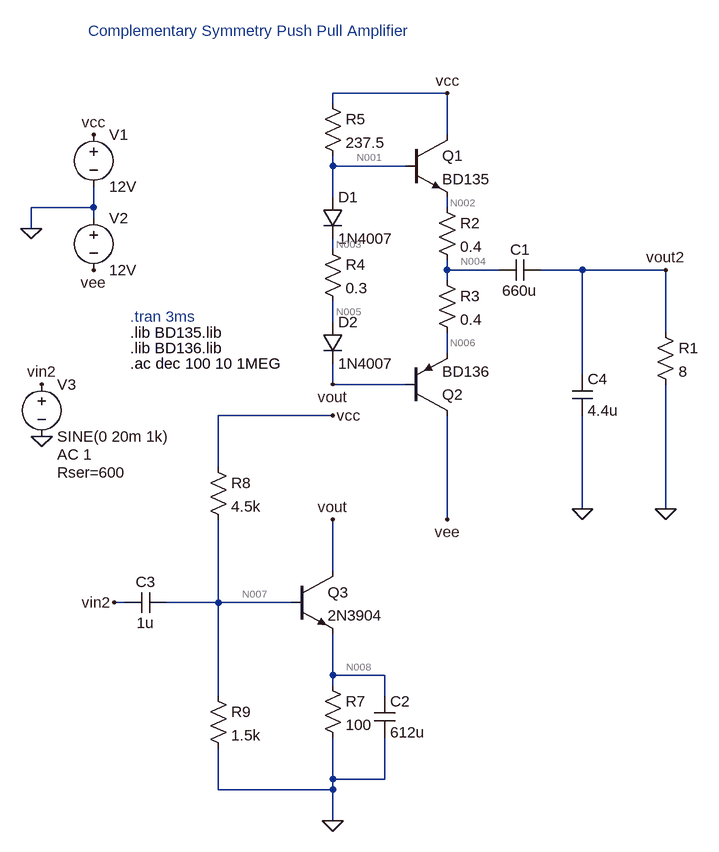
[diagram p0: schematic push_pull_AB.asc]
push_pull_AB.asc, the LTspice schematic file:
Version 4.1
SHEET 1 1272 1044
WIRE 880 -128 704 -128
WIRE 704 -112 704 -128
WIRE 880 -64 880 -128
WIRE 704 -16 704 -32
WIRE 816 -16 704 -16
WIRE 704 32 704 -16
WIRE 336 48 336 16
WIRE 336 48 240 48
WIRE 880 48 880 32
WIRE 336 64 336 48
WIRE 240 80 240 48
WIRE 704 112 704 96
WIRE 880 144 880 128
WIRE 960 144 880 144
WIRE 1088 144 1024 144
WIRE 1216 144 1088 144
WIRE 880 160 880 144
WIRE 704 224 704 192
WIRE 1216 240 1216 144
WIRE 880 272 880 240
WIRE 1088 304 1088 144
WIRE 704 320 704 288
WIRE 816 320 704 320
WIRE 704 368 528 368
WIRE 528 448 528 368
WIRE 1088 512 1088 368
WIRE 1216 512 1216 320
WIRE 880 528 880 368
WIRE 704 608 704 528
WIRE 384 656 368 656
WIRE 528 656 528 528
WIRE 528 656 448 656
WIRE 640 656 528 656
WIRE 704 768 704 704
WIRE 784 768 704 768
WIRE 704 784 704 768
WIRE 528 800 528 656
WIRE 784 800 784 768
WIRE 704 928 704 864
WIRE 784 928 784 864
WIRE 784 928 704 928
WIRE 528 944 528 880
WIRE 704 944 704 928
WIRE 704 944 528 944
WIRE 704 992 704 944
FLAG 336 -64 vcc
FLAG 240 80 0
FLAG 1216 512 0
FLAG 880 -128 vcc
FLAG 1216 144 vout2
FLAG 704 992 0
FLAG 256 320 vin2
FLAG 368 656 vin2
FLAG 704 368 vcc
FLAG 256 400 0
FLAG 704 320 vout
FLAG 704 528 vout
FLAG 1088 512 0
FLAG 336 144 vee
FLAG 880 528 vee
SYMBOL voltage 336 -80 R0
WINDOW 123 0 0 Left 0
WINDOW 39 0 0 Left 0
SYMATTR InstName V1
SYMATTR Value 12V
SYMBOL npn 816 -64 R0
SYMATTR InstName Q1
SYMATTR Value BD135
SYMBOL pnp 816 368 M180
SYMATTR InstName Q2
SYMATTR Value BD136
SYMBOL res 1200 224 R0
SYMATTR InstName R1
SYMATTR Value 8
SYMBOL res 864 32 R0
SYMATTR InstName R2
SYMATTR Value 0.4
SYMBOL res 864 144 R0
SYMATTR InstName R3
SYMATTR Value 0.4
SYMBOL res 688 96 R0
SYMATTR InstName R4
SYMATTR Value 0.3
SYMBOL diode 688 32 R0
SYMATTR InstName D1
SYMATTR Value 1N4007
SYMBOL diode 688 224 R0
SYMATTR InstName D2
SYMATTR Value 1N4007
SYMBOL res 688 -128 R0
SYMATTR InstName R5
SYMATTR Value 237.5
SYMBOL npn 640 608 R0
SYMATTR InstName Q3
SYMATTR Value 2N3904
SYMBOL res 688 768 R0
SYMATTR InstName R7
SYMATTR Value 100
SYMBOL res 512 432 R0
SYMATTR InstName R8
SYMATTR Value 4.5k
SYMBOL res 512 784 R0
SYMATTR InstName R9
SYMATTR Value 1.5k
SYMBOL cap 768 800 R0
SYMATTR InstName C2
SYMATTR Value 612u
SYMBOL cap 384 640 M90
WINDOW 0 0 32 VBottom 2
WINDOW 3 32 32 VTop 2
SYMATTR InstName C3
SYMATTR Value 1u
SYMBOL voltage 256 304 R0
WINDOW 123 24 124 Left 2
WINDOW 39 24 152 Left 2
SYMATTR Value2 AC 1
SYMATTR SpiceLine Rser=600
SYMATTR InstName V3
SYMATTR Value SINE(0 20m 1k)
SYMBOL cap 1072 304 R0
SYMATTR InstName C4
SYMATTR Value 4.4u
SYMBOL voltage 336 48 R0
WINDOW 123 0 0 Left 0
WINDOW 39 0 0 Left 0
SYMATTR InstName V2
SYMATTR Value 12V
SYMBOL cap 1024 128 R90
WINDOW 0 0 32 VBottom 2
WINDOW 3 32 32 VTop 2
SYMATTR InstName C1
SYMATTR Value 660u
TEXT 392 240 Left 2 !.lib BD135.lib
TEXT 392 264 Left 2 !.lib BD136.lib
TEXT 392 216 Left 2 ;.tran 3ms
TEXT 392 288 Left 2 !.ac dec 100 10 1MEG
TEXT 328 -224 Left 2 ;Complementary Symmetry Push Pull Amplifier

The netlist it stands for:
* push_pull_AB.asc
V1 vcc 0 12V
Q1 vcc N001 N002 0 BD135
Q2 vee vout N006 0 BD136
R1 vout2 0 8
R2 N002 N004 0.4
R3 N004 N006 0.4
R4 N003 N005 0.3
D1 N001 N003 1N4007
D2 N005 vout 1N4007
R5 vcc N001 237.5
Q3 vout N007 N008 0 2N3904
R7 N008 0 100
R8 vcc N007 4.5k
R9 N007 0 1.5k
C2 N008 0 612u
C3 vin2 N007 1u
V3 vin2 0 SINE(0 20m 1k) AC 1 Rser=600
C4 vout2 0 4.4u
V2 0 vee 12V
C1 vout2 N004 660u
.model D D
.lib standard.dio
.model NPN NPN
.model PNP PNP
.lib standard.bjt
.lib BD135.lib
.lib BD136.lib
* .tran 3ms
.ac dec 100 10 1MEG
* Complementary Symmetry Push Pull Amplifier
.backanno
.end

* Results of the author's LTspice run, read from the files saved beside the schematic
* Operating Point, zero values left out:
*   V(n001) = 6.844 V
*   V(vee) = -12 V
*   V(vout) = 5.438 V
*   V(n005) = 6.138 V
*   V(n008) = 2.177 V
*   V(vcc) = 12 V
*   V(n002) = 6.162 V
*   V(n006) = 6.153 V
*   V(n004) = 6.158 V
*   V(n003) = 6.145 V
*   V(n007) = 2.916 V
*   I(V1) = -35.4 mA
*   Ic(Q2) = -11.69 mA
*   Ib(Q2) = -62.91 µA
*   Ie(Q2) = 11.75 mA
*   I(R2) = 11.75 mA
*   I(R3) = 11.75 mA
*   I(R8) = 2.019 mA
*   I(R9) = 1.944 mA
*   I(D1) = 21.64 mA
*   Ic(Q3) = 21.7 mA
*   Ib(Q3) = 74.29 µA
*   Ie(Q3) = -21.77 mA
*   I(V2) = -11.69 mA
*   Ic(Q1) = 11.68 mA
*   Ib(Q1) = 72.35 µA
*   Ie(Q1) = -11.75 mA
*   I(R4) = 21.64 mA
*   I(R5) = 21.71 mA
*   I(R7) = 21.77 mA
*   I(D2) = 21.64 mA
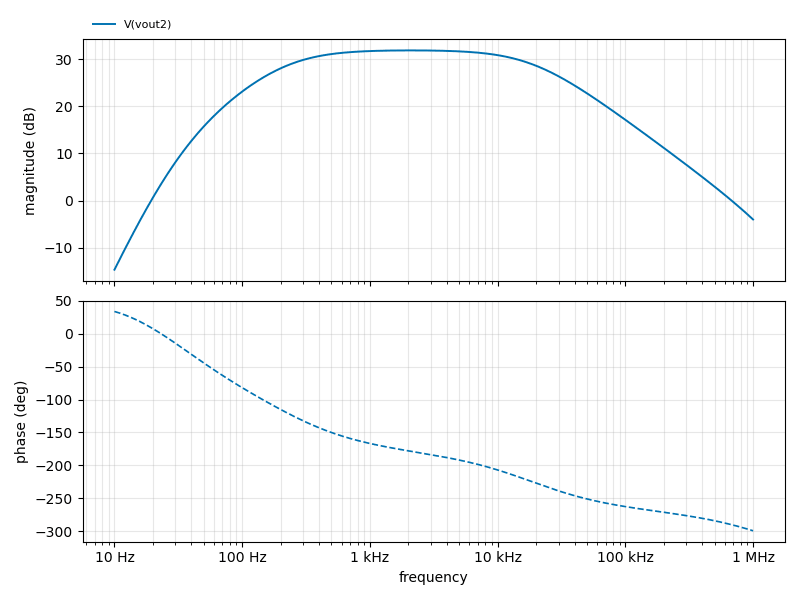
[diagram p1: AC Analysis of push_pull_AB.asc, plotted from the saved traces]
* AC Analysis, 1 run:
*   V(vout2): -14.65 dB at 10 Hz, -4.01 dB at 1 MHz, peak 31.84 dB at 2.089 kHz, 3 dB below the peak at 234.4 Hz and 18.98 kHz